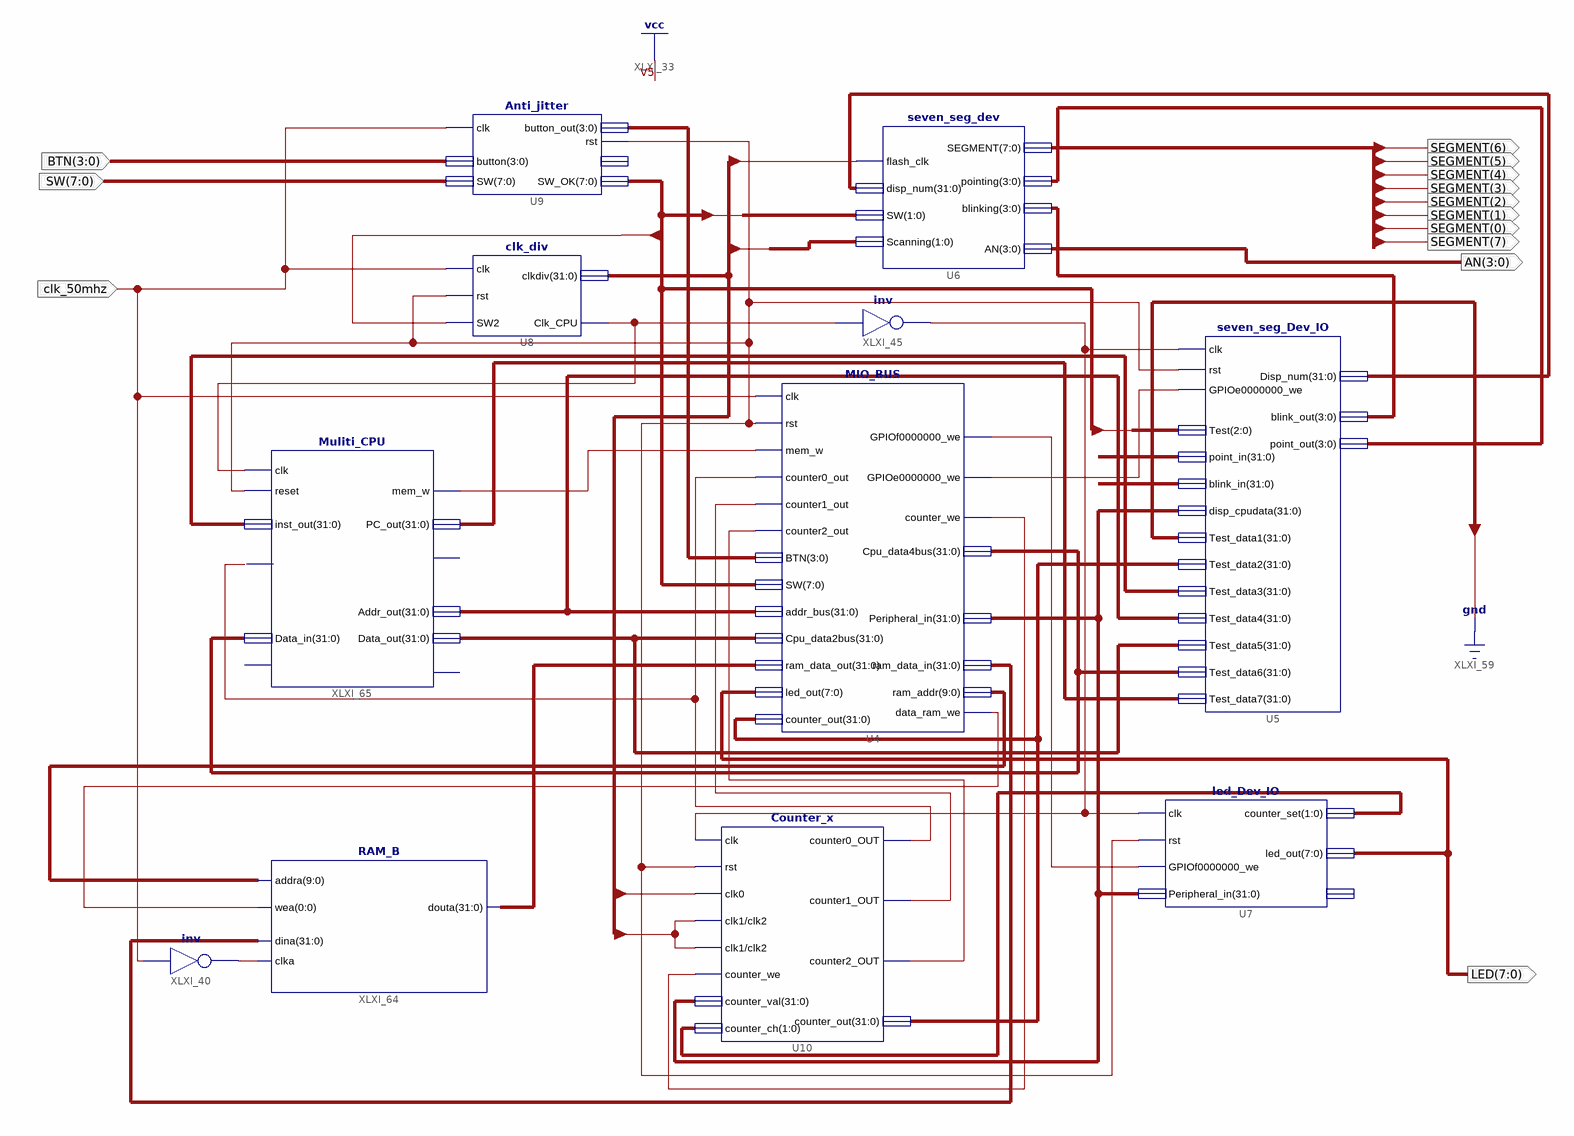
[diagram p0: schematic sheet 1]
// Xilinx ISE schematic Top_SCPU_IOBUS_Sch.sch (spartan3) as structural Verilog: 11 symbols, 13 ports
module Top_SCPU_IOBUS_Sch (
  input  [3:0] BTN,
  input  clk_50mhz,
  input  [7:0] SW,
  output [7:0] SEGMENT,
  output [3:0] AN,
  output [7:0] LED
);

  wire CPU_CLK, rst, XLXN_150, XLXN_175, XLXN_182, XLXN_183, XLXN_251, XLXN_261, XLXN_267, XLXN_272, XLXN_280;
  wire [0:0] XLXN_274;
  wire [1:0] XLXN_208;
  wire [3:0] blinke, BT, XLXN_61, XLXN_132;
  wire [7:0] SW_OK;
  wire [9:0] XLXN_275;
  wire [31:0] clk_div, pc, XLXN_59, XLXN_174, XLXN_198, XLXN_202, XLXN_212, XLXN_256, XLXN_258, XLXN_260,
       XLXN_273;

  clk_div U8 (.clk(clk_50mhz), .rst(rst), .SW2(SW_OK[2]), .clkdiv(clk_div), .Clk_CPU(CPU_CLK));
  seven_seg_dev U6 (
    .pointing(XLXN_61), .blinking(XLXN_132), .SW(SW_OK[1:0]), .Scanning(clk_div[19:18]), .disp_num(XLXN_59),
    .flash_clk(clk_div[24]), .SEGMENT(SEGMENT), .AN(AN));
  not XLXI_40 (XLXN_280, clk_50mhz);
  led_Dev_IO U7 (
    .clk(XLXN_175), .rst(rst), .GPIOf0000000_we(XLXN_267), .Peripheral_in(XLXN_212), .counter_set(XLXN_208),
    .led_out(LED));  // open: GPIOf0
  not XLXI_45 (XLXN_175, CPU_CLK);
  Counter_x U10 (
    .clk(XLXN_175), .rst(rst), .clk0(clk_div[7]), .clk1(clk_div[10]), .clk2(clk_div[10]),
    .counter_we(XLXN_272), .counter_val(XLXN_212), .counter_ch(XLXN_208), .counter0_OUT(XLXN_261),
    .counter1_OUT(XLXN_182), .counter2_OUT(XLXN_183), .counter_out(XLXN_202));
  MIO_BUS U4 (
    .clk(clk_50mhz), .rst(rst), .mem_w(XLXN_251), .counter0_out(XLXN_261), .counter1_out(XLXN_182),
    .counter2_out(XLXN_183), .BTN(BT), .SW(SW_OK), .ram_data_out(XLXN_174), .led_out(LED),
    .counter_out(XLXN_202), .GPIOf0000000_we(XLXN_267), .GPIOe0000000_we(XLXN_150), .counter_we(XLXN_272),
    .ram_data_in(XLXN_256), .data_ram_we(XLXN_274[0]), .ram_addr(XLXN_275), .Cpu_data4bus(XLXN_273),
    .Peripheral_in(XLXN_212), .Cpu_data2bus(XLXN_198), .addr_bus(XLXN_258));
  Anti_jitter U9 (
    .clk(clk_50mhz), .SW(SW), .button_out(BT), .SW_OK(SW_OK), .button(BTN), .rst(rst));  // open: button_pulse
  seven_seg_Dev_IO U5 (
    .clk(XLXN_175), .Test(SW_OK[7:5]), .point_in({32{1'b1}}), .blink_in({{24{1'b0}}, blinke, blinke}),
    .disp_cpudata(XLXN_212), .Test_data1({2'b00, pc[31:2]}), .Test_data2(XLXN_202), .Test_data3(XLXN_260),
    .Test_data4(XLXN_258), .Test_data5(XLXN_198), .Test_data6(XLXN_273), .Test_data7(pc),
    .blink_out(XLXN_132), .point_out(XLXN_61), .rst(rst), .GPIOe0000000_we(XLXN_150), .Disp_num(XLXN_59));
  RAM_B XLXI_64 (.addra(XLXN_275), .clka(XLXN_280), .wea(XLXN_274[0]), .dina(XLXN_256), .douta(XLXN_174));
  Muliti_CPU XLXI_65 (
    .clk(CPU_CLK), .INT(XLXN_261), .inst_out(XLXN_260), .reset(rst), .Data_in(XLXN_273), .mem_w(XLXN_251),
    .PC_out(pc), .Addr_out(XLXN_258), .Data_out(XLXN_198));  // open: MIO_ready, CPU_MIO, state
endmodule
